# EAGLE design tamagotchi (EAGLE 9.6.2)
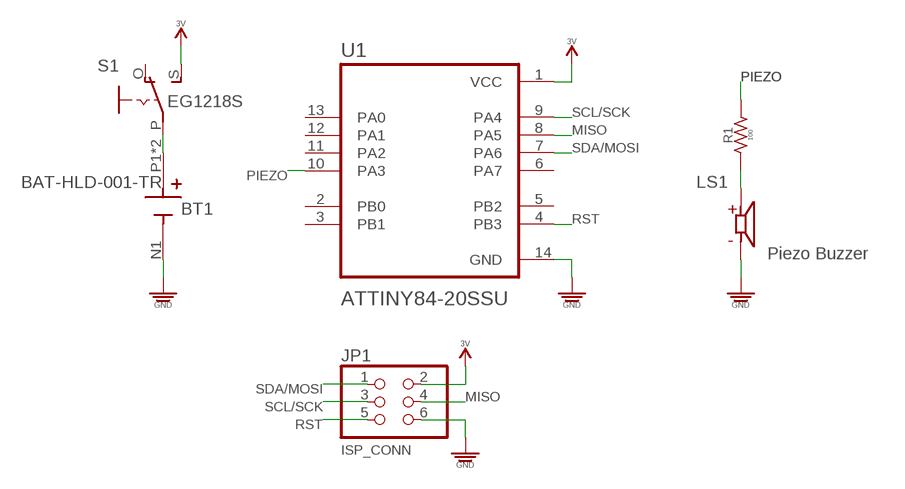
[diagram p0: schematic, sheet 1]

## Parts
BT1  BAT-HLD-001-TR  [BAT_BAT-HLD-001-TR]
JP1  PINHD-2X3  [2X03]
LS1  Piezo Buzzer  CSS-0575A-SMT  [CUI_CSS-0575A-SMT]
R1  100  100Ω_SMD-0805_1/8W-5%  [RESC2012X60_SMD-0805]
S1  EG1218S  [EG1218]
U1  ATTINY84-20SSU  [SOIC127P600X175-14N]

## Nets
3V: JP1.2 S1.S U1.1(VCC)
GND: BT1.N1(-) JP1.6 LS1.2(N) U1.14(GND)
MISO: JP1.4 U1.8(PA5)
N$1: LS1.1(P) R1.1
N$2: BT1.P1(+) BT1.P2(+) S1.P
PIEZO: R1.2 U1.10(PA3)
RST: JP1.5 U1.4(PB3)
SCL/SCK: JP1.3 U1.9(PA4)
SDA/MOSI: JP1.1 U1.7(PA6)
Unconnected: S1.O U1.2(PB0) U1.3(PB1) U1.5(PB2) U1.6(PA7) U1.11(PA2) U1.12(PA1) U1.13(PA0)

## Notes on the sheet
- ISP_CONN

## Library data of the parts
BT1 = BAT-HLD-001-TR:BAT-HLD-001-TR: Battery Retainer Coin, 20.0mm 1 Cell SMD (SMT) Tab; DESCRIPTION: Holder for CR2032 and CR2025 Batteries, Surface-Mount, Tape and Reel Packaging; DIGI-KEY_PART_NUMBER: BAT-HLD-001-TRTR-ND; MF: Linx Technologies; MP: BAT-HLD-001-TR; PACKAGE: None; PURCHASE-URL: https://pricing.snapeda.com/search/part/BAT-HLD-001-TR/?ref=eda
JP1 = pinhead:PINHD-2X3: PIN HEADER
LS1 = CSS-0575A-SMT:CSS-0575A-SMT: 5 mm, 3 V, 75 dB, Surface Mount (SMT), Magnetic Audio Transducer Buzzer; CUI_PURCHASE_URL: https://www.cuidevices.com/product/audio/buzzers/audio-transducers/css-0575a-smt-tr?utm_source=snapeda.com&utm_medium=referral&utm_campaign=snapedaBOM; DESCRIPTION: 5 mm, 3 V, 76 dB, Surface Mount (SMT), Magnetic Audio Transducer Buzzer; DIGI-KEY_PART_NUMBER: 102-2201-2-ND; MF: CUI Devices; MP: CSS-0575A-SMT-TR; PACKAGE: None; PURCHASE-URL: https://pricing.snapeda.com/search/part/CSS-0575A-SMT-TR/?ref=eda
R1 = PiB_resistors:100Ω; DATASHEET: http://www.yageo.com/NewPortal/yageodocoutput?fileName=/pdf/R-Chip/PYu-AC_51_RoHS_L_6.pdf; DIST: Digikey; DISTLINK: https://www.digikey.com/products/en?keywords=YAG3757CT-ND; DISTPN: YAG3757CT-ND; MFR: Yageo; MPN: AC0805JR-07100RL
S1 = EG1218:EG1218: SLIDING SWITCH 0.1" spacing through hole, vertical SPDT slide switch http://www.ladyada.net/library/pcb/eaglelibrary.html; DESCRIPTION: Slide Switch SPDT Through Hole; DIGI-KEY_PART_NUMBER: EG1903-ND; MF: E-Switch; MP: EG1218; PACKAGE: None; PURCHASE-URL: https://pricing.snapeda.com/search/part/EG1218/?ref=eda
U1 = ATTINY84-20SSU:ATTINY84-20SSU; DESCRIPTION: AVR AVR® ATtiny Microcontroller IC 8-Bit 20MHz 8KB (4K x 16) FLASH 14-SOIC; DIGI-KEY_PART_NUMBER: ATTINY84-20SSU-ND; MF: Microchip Technology / Atmel; MP: ATTINY84-20SSU; PACKAGE: None; PURCHASE-URL: https://pricing.snapeda.com/search/part/ATTINY84-20SSU/?ref=eda

## Board
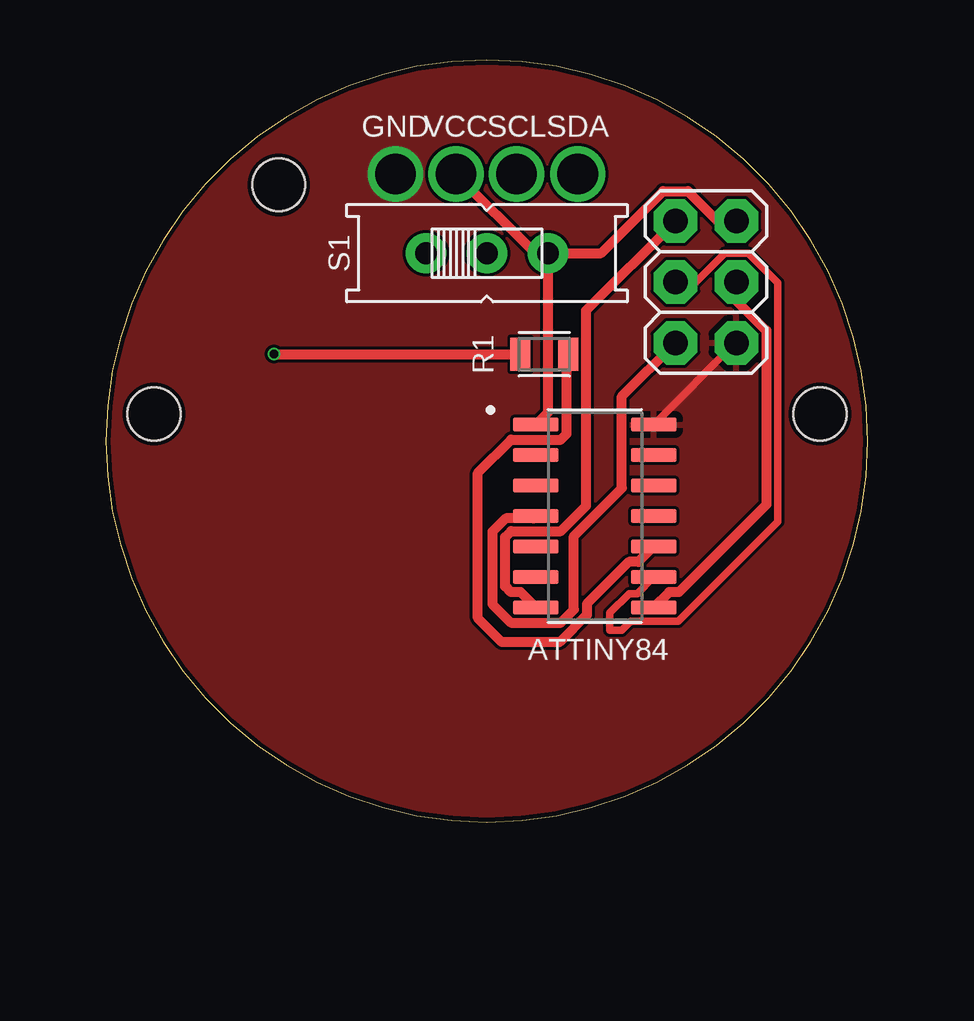
[diagram p1: board, top side]
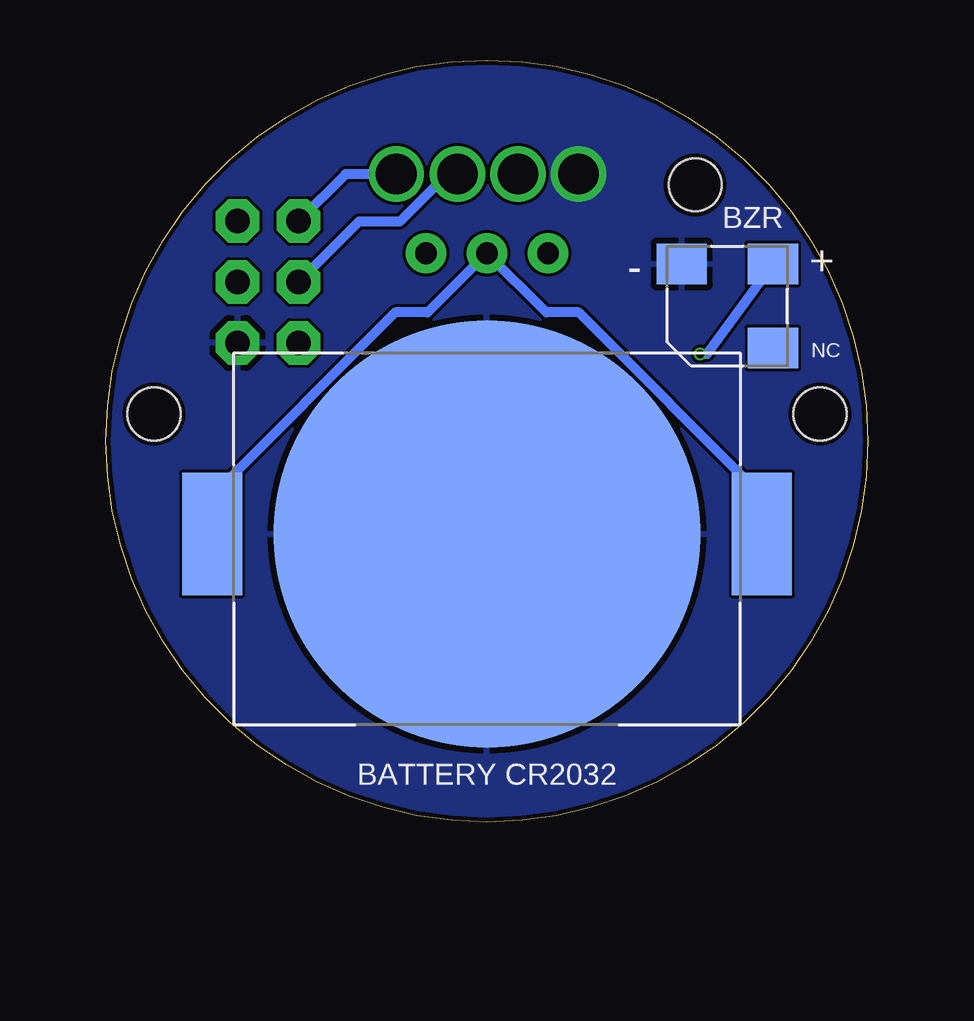
[diagram p2: board, bottom side, seen from below]

Size 31.75 x 31.75 mm. Coordinates in mm from the lower left corner, seen from the top.
Outline: 15.88,0 arc90 31.75,15.88 arc90 15.88,31.75 arc90 0,15.88 arc90 15.88,0
Copper layers (1*16): Top 0.035mm / dielectric 1.6mm / Bottom 0.035mm
Design rules "jlcpcb-2layers": minimum track width 5mil, minimum drill 0.3mm, track to track 5mil, track to pad 5mil, pad to pad 5mil, via to via 5mil, smd to smd 5mil, copper to edge 0.2mm, drill to drill 6mil, minimum pad ring 10mil, minimum via ring 3mil, stop-mask expansion 4mil, vias tented up to drill 0mil, thermal gap 10mil
Holes 2.2 mm at 2,17 29.75,17 7.2,26.55

### Footprints (pad centres in the part's own frame; a part is rotated, then mirrored left to right if it is on the bottom)
BAT_BAT-HLD-001-TR = smd 17.8 x 17.8: N1 0,0 | smd 2.5 x 5.1: P1 -11.45,0; P2 11.45,0
2X03 = drill 1.016 octagon: 1 -2.54,-1.27; 2 -2.54,1.27; 3 0,-1.27; 4 0,1.27; 5 2.54,-1.27; 6 2.54,1.27
CUI_CSS-0575A-SMT = smd 2.1 x 1.7: 1 -1.9,-1.75; 2 1.9,-1.75; 3 -1.9,1.75
RESC2012X60_SMD-0805 = smd 0.838 x 1.379: 1 -0.995,0; 2 0.995,0
EG1218 = drill 0.9 pad 1.676: O -2.54,0; P 0,0; S 2.54,0
SOIC127P600X175-14N = smd 1.9 x 0.6: 1 -2.455,3.81; 2 -2.455,2.54; 3 -2.455,1.27; 4 -2.455,0; 5 -2.455,-1.27; 6 -2.455,-2.54; 7 -2.455,-3.81; 8 2.455,-3.81; 9 2.455,-2.54; 10 2.455,-1.27; 11 2.455,0; 12 2.455,1.27; 13 2.455,2.54; 14 2.455,3.81

### Placement (x,y rotation side)
BT1  15.88,12 0 bottom
JP1  25,22.5 270 top
LS1  5.86,21.5 180 bottom
R1  18.26,19.49 0 top
S1  15.88,23.7 0 top
U1  20.37,12.75 0 top

### Tracks (layer width: path | path; a pad name or v marks a point on that pad's centre or on a via)
3V  (via drill 1.7 pad 2.3)
  Top 0.406: S1.S 18.41,17.06 U1.1 | v14.58,27 17.88,23.7 S1.S | S1.S 20.63,23.7 23.21,26.29 24.25,26.29 25.49,25.04 JP1.2
GND  (via drill 1.7 pad 2.3)
  Top 0.305: U1.14 26.23,19.96 JP1.6
  other vias: 12.06,27
  pour Top: -0.5,32.5 -0.5,-0.5 32,-0.5 32,32.5
  pour Bottom: 0,32 32,32 32,-0.5 -0.5,-0.5 -0.5,32
MISO
  Top 0.406: U1.8 23.46,9.58 23.87,9.58 27.52,13.23 27.52,20.48 26.27,21.72 JP1.4
N$1  (via drill 0.35)
  Top 0.406: v7,19.5 R1.1
  Bottom 0.406: LS1.1 6.71,19.5 v7,19.5
N$2
  Bottom 0.406: BT1.P2 4.42,13.6 12.05,21.23 13.4,21.23 S1.P 18.34,21.23 19.7,21.23 27.32,13.6 BT1.P1
PIEZO
  Top 0.406: U1.10 22.18,10.84 21.78,10.84 20.03,9.09 20.03,8.63 18.9,7.5 16.5,7.5 15.5,8.5 15.5,14.55 16.88,15.93 18.96,15.93 19.2,16.17 19.2,19.43 R1.2
RST
  Top 0.406: U1.4 17.82,12.65 16.66,12.65 16.1,12.09 16.1,9.08 16.87,8.31 18.96,8.31 19.5,8.85 19.5,11.91 21.5,13.91 21.5,17.73 JP1.5
SCL/SCK  (via drill 1.7 pad 2.3)
  Top 0.305: JP1.3 24.58,22.5 25.78,23.69 26.76,23.69 28,22.46 28,12.51 23.85,8.36 21.86,8.36 21.5,8 21,8 21,8.72 21.8,9.52 22.13,9.52 U1.9
  Bottom 0.406: v17.11,27 17.53,27 19.51,25.02 21.21,25.02 JP1.3
SDA/MOSI  (via drill 1.7 pad 2.3)
  Top 0.406: U1.7 17.27,9.58 16.87,9.58 16.64,9.82 16.64,11.87 16.88,12.12 18.96,12.12 20,13.17 20,21.32 JP1.1
  Bottom 0.406: v19.65,27 21.77,27 JP1.1

### Text on the board
tPlace: GND | VCC | SCL | SDA | S1 | R1 | ATTINY84
bPlace: BZR | BATTERY CR2032